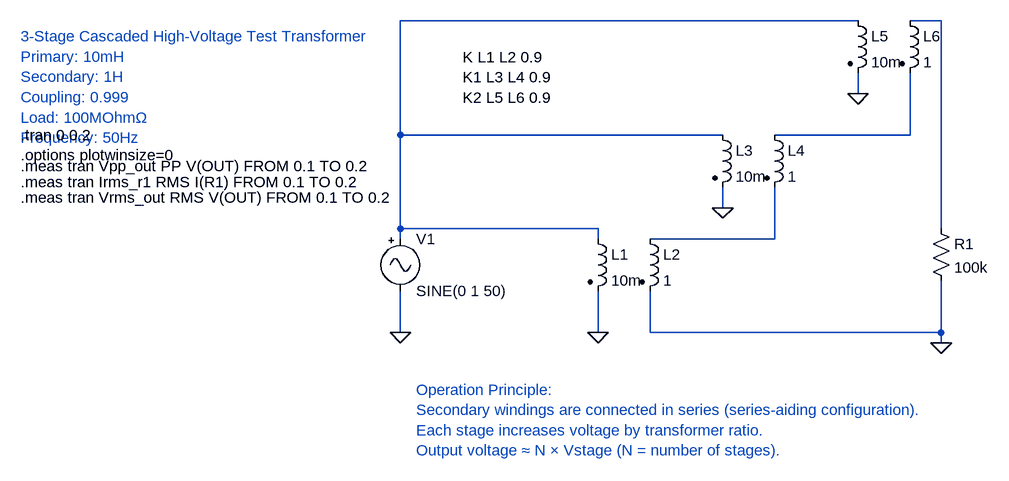
[diagram p0: schematic cascade_hv_transformer.asc]
cascade_hv_transformer.asc, the LTspice schematic file:
Version 4
SHEET 1 1020 728
WIRE 800 -16 96 -16
WIRE 928 -16 880 -16
WIRE 800 96 800 64
WIRE 96 160 96 -16
WIRE 592 160 96 160
WIRE 880 160 880 64
WIRE 880 160 672 160
WIRE 592 272 592 240
WIRE 96 304 96 160
WIRE 400 304 96 304
WIRE 928 304 928 -16
WIRE 96 320 96 304
WIRE 400 320 400 304
WIRE 672 320 672 240
WIRE 672 320 480 320
WIRE 96 464 96 400
WIRE 400 464 400 400
WIRE 480 464 480 400
WIRE 928 464 928 384
WIRE 928 464 480 464
WIRE 928 480 928 464
FLAG 96 464 0
FLAG 928 480 0
FLAG 400 464 0
FLAG 592 272 0
FLAG 800 96 0
SYMBOL Misc/signal 96 304 R0
SYMATTR InstName V1
SYMATTR Value SINE(0 1 50)
SYMBOL ind2 384 304 R0
SYMATTR InstName L1
SYMATTR Value 10m
SYMATTR Type ind
SYMATTR SpiceLine Rser=0.1
SYMBOL ind2 464 304 R0
SYMATTR InstName L2
SYMATTR Value 1
SYMATTR Type ind
SYMBOL ind2 576 144 R0
SYMATTR InstName L3
SYMATTR Value 10m
SYMATTR Type ind
SYMATTR SpiceLine Rser=0.1
SYMBOL ind2 656 144 R0
SYMATTR InstName L4
SYMATTR Value 1
SYMATTR Type ind
SYMBOL ind2 784 -32 R0
SYMATTR InstName L5
SYMATTR Value 10m
SYMATTR Type ind
SYMATTR SpiceLine Rser=0.1
SYMBOL ind2 864 -32 R0
SYMATTR InstName L6
SYMATTR Value 1
SYMATTR Type ind
SYMBOL Res 912 288 R0
SYMATTR InstName R1
SYMATTR Value 100k
TEXT 192 40 Left 2 !K L1 L2 0.9\nK1 L3 L4 0.9\nK2 L5 L6 0.9
TEXT -488 208 Left 2 !.meas tran Vpp_out PP V(OUT) FROM 0.1 TO 0.2
TEXT -488 256 Left 2 !.meas tran Vrms_out RMS V(OUT) FROM 0.1 TO 0.2
TEXT -488 232 Left 2 !.meas tran Irms_r1 RMS I(R1) FROM 0.1 TO 0.2
TEXT -488 8 Left 2 ;3-Stage Cascaded High-Voltage Test Transformer\nPrimary: 10mH\nSecondary: 1H\nCoupling: 0.999\nLoad: 100MOhmΩ\nFrequency: 50Hz
TEXT -488 160 Left 2 !.tran 0 0.2\n.options plotwinsize=0
TEXT 120 552 Left 2 ;Operation Principle:\nSecondary windings are connected in series (series-aiding configuration).\nEach stage increases voltage by transformer ratio.\nOutput voltage ≈ N × Vstage (N = number of stages).

The netlist it stands for:
* cascade_hv_transformer.asc
V1 N001 0 SINE(0 1 50)
L1 N001 0 10m Rser=0.1
L2 N004 0 1
L3 N001 0 10m Rser=0.1
L4 N003 N004 1
L5 N001 0 10m Rser=0.1
L6 N002 N003 1
R1 N002 0 100k
K L1 L2 0.9
K1 L3 L4 0.9
K2 L5 L6 0.9
.meas tran Vpp_out PP V(OUT) FROM 0.1 TO 0.2
.meas tran Vrms_out RMS V(OUT) FROM 0.1 TO 0.2
.meas tran Irms_r1 RMS I(R1) FROM 0.1 TO 0.2
* 3-Stage Cascaded High-Voltage Test Transformer
* Primary: 10mH
* Secondary: 1H
* Coupling: 0.999
* Load: 100MOhmΩ
* Frequency: 50Hz
.tran 0 0.2
.options plotwinsize=0
* Operation Principle:
* Secondary windings are connected in series (series-aiding configuration).
* Each stage increases voltage by transformer ratio.
* Output voltage ≈ N × Vstage (N = number of stages).
.backanno
.end